# Altium schematic sheet MCU et al.SchDoc: MCU et al
size A3; DrawnBy: J Gray; Engineer: J Gray; SheetNumber: 1; SheetTotal: 1
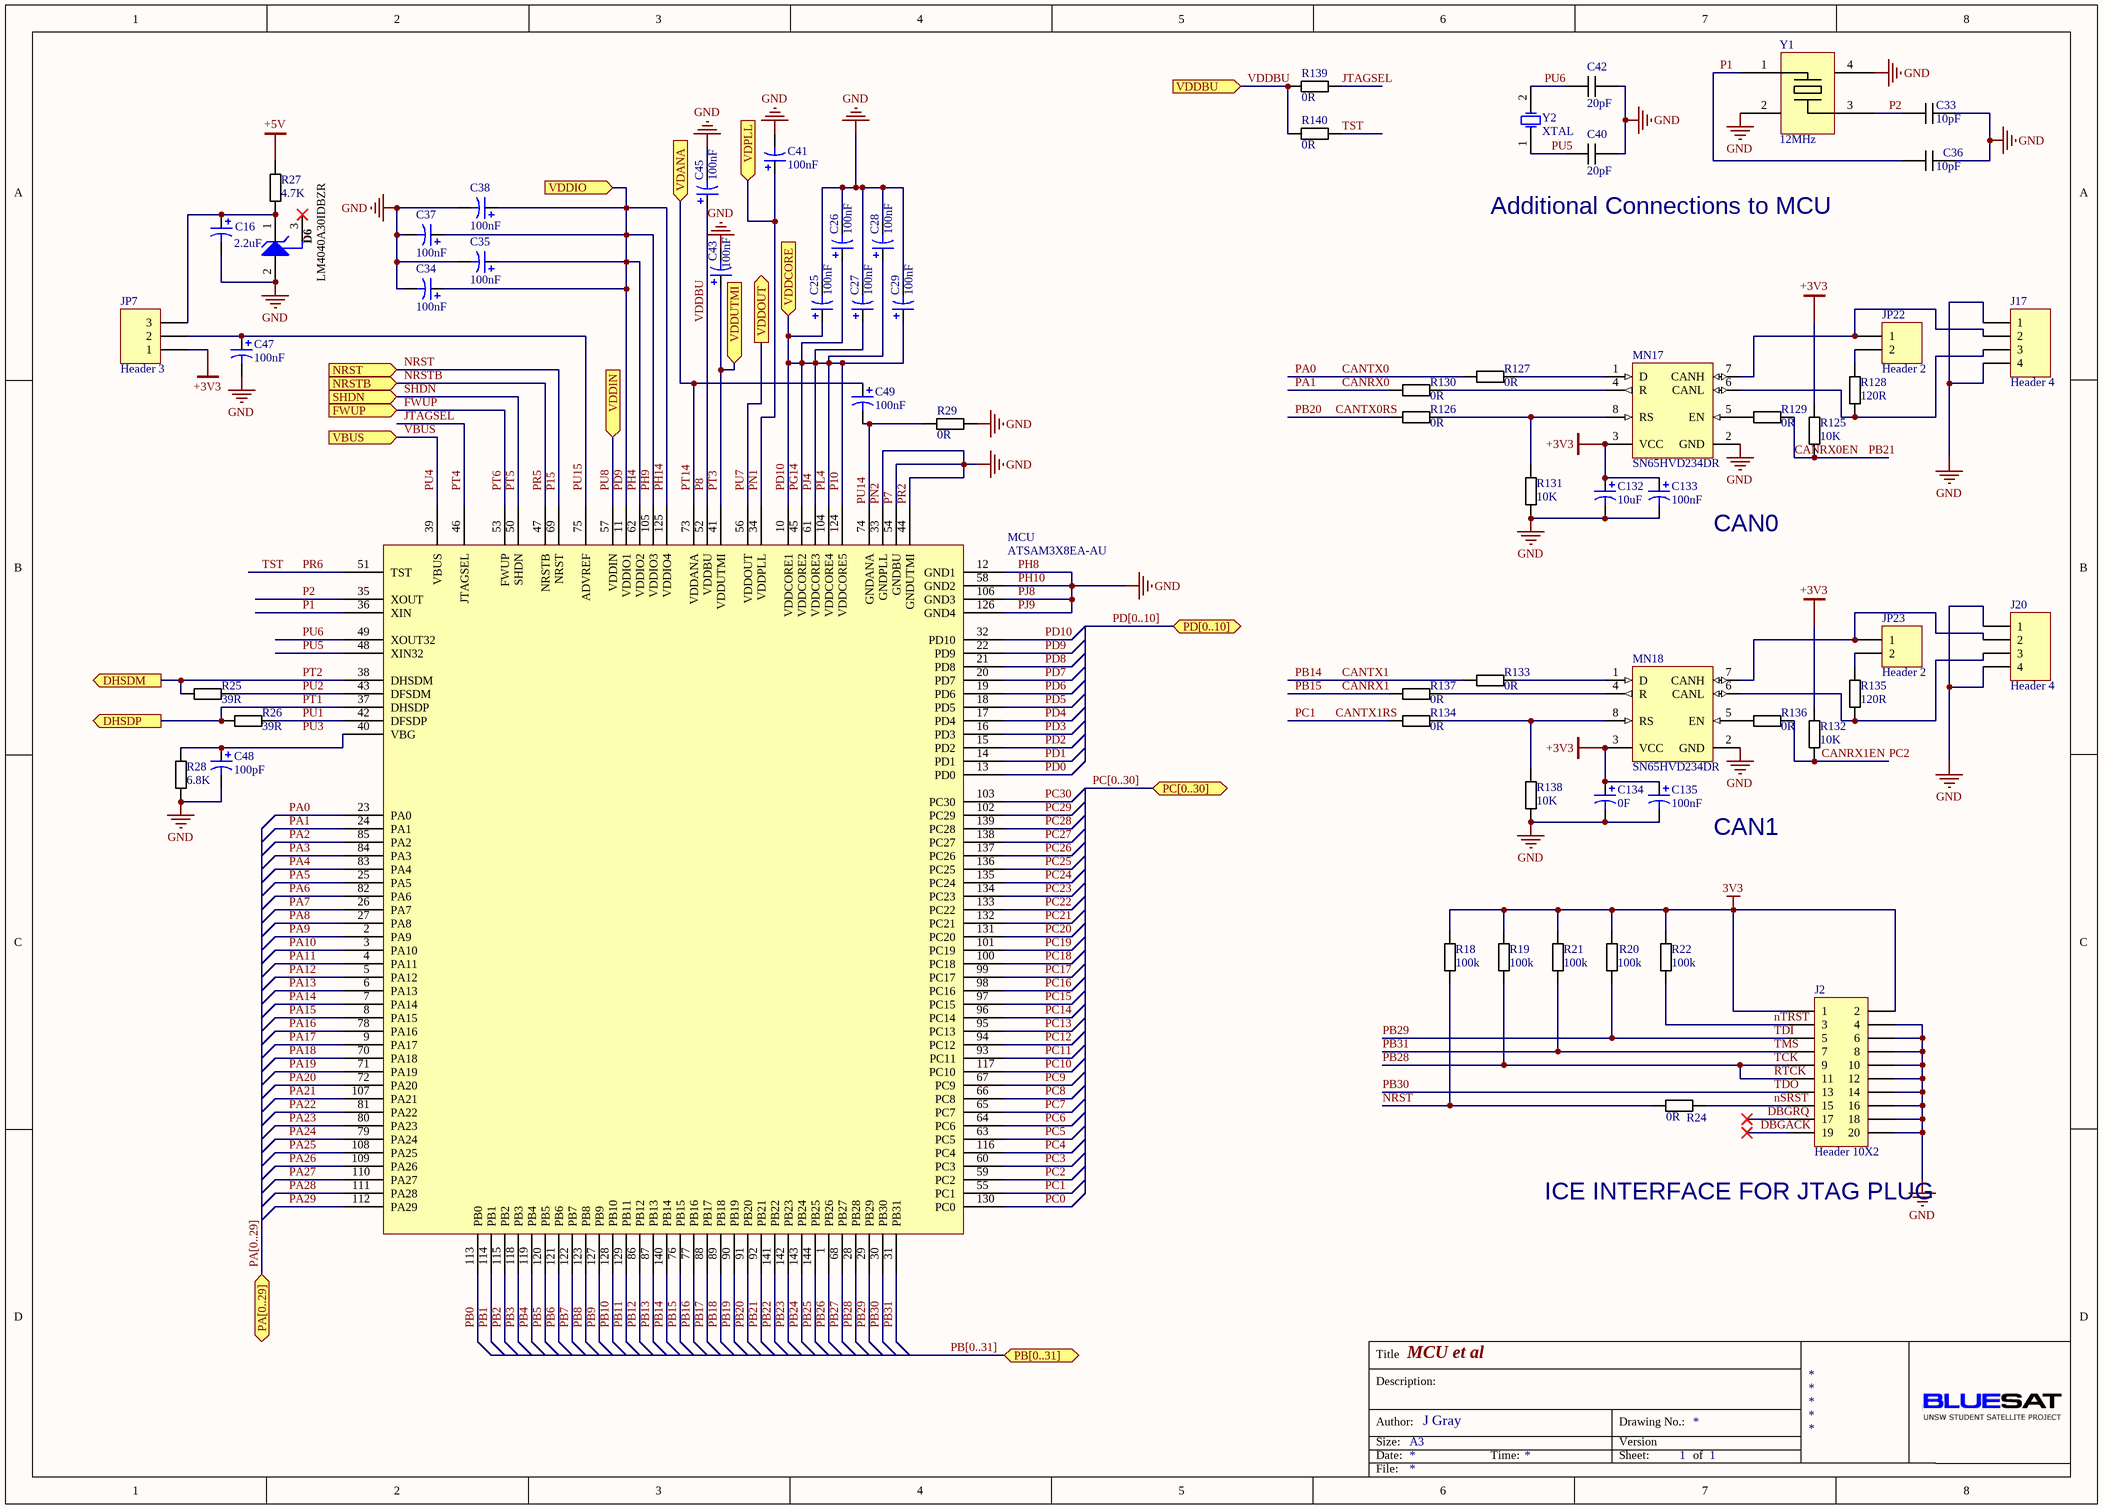
[diagram p0: MCU et al.SchDoc]

## Parts
C16  value 2.2uF  [0805 Cap]  (hidden comment: Cap Pol3)
C25  value 100nF  [0805 Cap]  (hidden comment: Cap Pol3)
C26  value 100nF  [0805 Cap]  (hidden comment: Cap Pol3)
C27  value 100nF  [0805 Cap]  (hidden comment: Cap Pol3)
C28  value 100nF  [0805 Cap]  (hidden comment: Cap Pol3)
C29  value 100nF  [0805 Cap]  (hidden comment: Cap Pol3)
C33  value 10pF  [0805 Cap]  (hidden comment: 0805 Cap)
C34  value 100nF  [0805 Cap]  (hidden comment: Cap Pol3)
C35  value 100nF  [0805 Cap]  (hidden comment: Cap Pol3)
C36  value 10pF  [0805 Cap]  (hidden comment: 0805 Cap)
C37  value 100nF  [0805 Cap]  (hidden comment: Cap Pol3)
C38  value 100nF  [0805 Cap]  (hidden comment: Cap Pol3)
C40  value 20pF  [0805 Cap]  (hidden comment: 0805 Cap)
C41  value 100nF  [0805 Cap]  (hidden comment: Cap Pol3)
C42  value 20pF  [0805 Cap]  (hidden comment: 0805 Cap)
C43  value 100nF  [0805 Cap]  (hidden comment: Cap Pol3)
C45  value 100nF  [0805 Cap]  (hidden comment: Cap Pol3)
C47  value 100nF  [0805 Cap]  (hidden comment: Cap Pol3)
C48  value 100pF  [0805 Cap]  (hidden comment: Cap Pol3)
C49  value 100nF  [0805 Cap]  (hidden comment: Cap Pol3)
C132  value 10uF  [0805 Cap]  (hidden comment: Cap Pol3)
C133  value 100nF  [0805 Cap]  (hidden comment: Cap Pol3)
C134  value 0F  [0805 Cap]  (hidden comment: Cap Pol3)
C135  value 100nF  [0805 Cap]  (hidden comment: Cap Pol3)
D6  LM4040A30IDBZR  [TI-DBZ3_N]
J2  Header 10X2  [HDR2X10 (JTAG)]
J17  Header 4  [HDR1X4]
J20  Header 4  [HDR1X4]
JP7  Header 3  [HDR1X3]
JP22  Header 2  [HDR1X2]
JP23  Header 2  [HDR1X2]
MCU  ATSAM3X8EA-AU  [LQFP144_M]
MN17  SN65HVD234DR  [D8_L]
MN18  SN65HVD234DR  [D8_L]
R18  value 100k  [0805 Resistor]  (hidden comment: 0805 Resistor)
R19  value 100k  [0805 Resistor]  (hidden comment: 0805 Resistor)
R20  value 100k  [0805 Resistor]  (hidden comment: 0805 Resistor)
R21  value 100k  [0805 Resistor]  (hidden comment: 0805 Resistor)
R22  value 100k  [0805 Resistor]  (hidden comment: 0805 Resistor)
R24  value 0R  [0805 Resistor]  (hidden comment: 0805 Resistor)
R25  value 39R  [0805 Resistor]  (hidden comment: 0805 Resistor)
R26  value 39R  [0805 Resistor]  (hidden comment: 0805 Resistor)
R27  value 4.7K  [0805 Resistor]  (hidden comment: 0805 Resistor)
R28  value 6.8K  [0805 Resistor]  (hidden comment: 0805 Resistor)
R29  value 0R  [0805 Resistor]  (hidden comment: 0805 Resistor)
R125  value 10K  [0805 Resistor]  (hidden comment: 0805 Resistor)
R126  value 0R  [0805 Resistor]  (hidden comment: 0805 Resistor)
R127  value 0R  [0805 Resistor]  (hidden comment: 0805 Resistor)
R128  value 120R  [0805 Resistor]  (hidden comment: 0805 Resistor)
R129  value 0R  [0805 Resistor]  (hidden comment: 0805 Resistor)
R130  value 0R  [0805 Resistor]  (hidden comment: 0805 Resistor)
R131  value 10K  [0805 Resistor]  (hidden comment: 0805 Resistor)
R132  value 10K  [0805 Resistor]  (hidden comment: 0805 Resistor)
R133  value 0R  [0805 Resistor]  (hidden comment: 0805 Resistor)
R134  value 0R  [0805 Resistor]  (hidden comment: 0805 Resistor)
R135  value 120R  [0805 Resistor]  (hidden comment: 0805 Resistor)
R136  value 0R  [0805 Resistor]  (hidden comment: 0805 Resistor)
R137  value 0R  [0805 Resistor]  (hidden comment: 0805 Resistor)
R138  value 10K  [0805 Resistor]  (hidden comment: 0805 Resistor)
R139  value 0R  [0805 Resistor]  (hidden comment: 0805 Resistor)
R140  value 0R  [0805 Resistor]  (hidden comment: 0805 Resistor)
Y1  12MHz  [7V-12.000MAAE-T]
Y2  XTAL  [ABS07]

## Ports
DHSDM (out), DHSDP (out), FWUP (in), NRST (in), NRSTB (in), PA[0..29] (bidir), PB[0..31] (bidir), PC[0..30] (bidir), PD[0..10] (bidir), SHDN (in), VBUS (in), VDANA (in), VDDBU (in), VDDCORE (in), VDDIN (in), VDDIO (in), VDDOUT (out), VDDUTMI (in), VDPLL (in)

## Nets
3V3: J2.1 J2.2 R18.2 R19.2 R20.2 R21.2 R22.2
+3V3: C132.1 C133.1 C134.1 C135.1 JP7.1 MN17.3(VCC) MN18.3(VCC) R125.2 R132.2
+5V: R27.2
P7: C16.2 C25.2 C26.2 C27.2 C28.2 C29.2 C33.2 C34.2 C35.2 C36.2 C37.2 C38.2 C40.2 C41.2 C42.2 C43.2 C45.2 C47.2 C48.2 C132.2 C133.2 C134.2 C135.2 D6.2(ANODE) J2.4 J2.6 J2.8 J2.10 J2.12 J2.14 J2.16 J2.18 J2.20 J17.1 J17.4 J20.1 J20.4 MCU.12(GND1) MCU.33(GNDPLL) MCU.44(GNDUTMI) MCU.54(GNDBU) MCU.58(GND2) MCU.106(GND3) MCU.126(GND4) MN17.2(GND) MN18.2(GND) R28.1 R29.1 R131.1 R138.1 Y1.2 Y1.4  [also labelled GND, PH10, PH8, PJ8, PJ9, PN2, PR2]
CANRX0: MCU.24(PA1) R130.1  [also labelled PA1]
CANRX0EN: MCU.92(PB21) R125.1 R129.2  [also labelled PB21]
CANRX1: MCU.76(PB15) R137.1  [also labelled PB15]
CANRX1EN: MCU.59(PC2) R132.1 R136.2  [also labelled PC2]
CANTX0: MCU.23(PA0) R127.1  [also labelled PA0]
CANTX0RS: MCU.91(PB20) R126.1  [also labelled PB20]
CANTX1: MCU.140(PB14) R133.1  [also labelled PB14]
CANTX1RS: MCU.55(PC1) R134.1  [also labelled PC1]
DBGACK: J2.19
DBGRQ: J2.17
FWUP: MCU.53(FWUP) ; port FWUP  [also labelled PT6]
JTAGSEL: MCU.46(JTAGSEL) R139.2  [also labelled PT4]
NRST: MCU.69(NRST) R18.1 R24.1 ; port NRST  [also labelled P15]
NRSTB: MCU.47(NRSTB) ; port NRSTB  [also labelled PR5]
nSRST: J2.15 R24.2
nTRST: J2.3 R22.1
P1: C36.1 MCU.36(XIN) Y1.1
P2: C33.1 MCU.35(XOUT) Y1.3
P8: C45.1 MCU.52(VDDBU) R139.1 R140.1 ; port VDDBU  [also labelled VDDBU]
P10: C25.1 C26.1 C27.1 C28.1 C29.1 MCU.10(VDDCORE1) MCU.32(PD10) MCU.45(VDDCORE2) MCU.61(VDDCORE3) MCU.104(VDDCORE4) MCU.124(VDDCORE5) ; port VDDCORE  [also labelled PD10, PG14, PJ4, PL4]
PA2: MCU.85(PA2)
PA3: MCU.84(PA3)
PA4: MCU.83(PA4)
PA5: MCU.25(PA5)
PA6: MCU.82(PA6)
PA7: MCU.26(PA7)
PA8: MCU.27(PA8)
PA9: MCU.2(PA9)
PA10: MCU.3(PA10)
PA11: MCU.4(PA11)
PA12: MCU.5(PA12)
PA13: MCU.6(PA13)
PA14: MCU.7(PA14)
PA15: MCU.8(PA15)
PA16: MCU.78(PA16)
PA17: MCU.9(PA17)
PA18: MCU.70(PA18)
PA19: MCU.71(PA19)
PA20: MCU.72(PA20)
PA21: MCU.107(PA21)
PA22: MCU.81(PA22)
PA23: MCU.80(PA23)
PA24: MCU.79(PA24)
PA25: MCU.108(PA25)
PA26: MCU.109(PA26)
PA27: MCU.110(PA27)
PA28: MCU.111(PA28)
PA29: MCU.112(PA29)
PB0: MCU.113(PB0)
PB1: MCU.114(PB1)
PB2: MCU.115(PB2)
PB3: MCU.118(PB3)
PB4: MCU.119(PB4)
PB5: MCU.120(PB5)
PB6: MCU.121(PB6)
PB7: MCU.122(PB7)
PB8: MCU.123(PB8)
PB9: MCU.127(PB9)
PB10: MCU.128(PB10)
PB11: MCU.129(PB11)
PB12: MCU.86(PB12)
PB13: MCU.87(PB13)
PB16: MCU.77(PB16)
PB17: MCU.88(PB17)
PB18: MCU.89(PB18)
PB19: MCU.90(PB19)
PB22: MCU.141(PB22)
PB23: MCU.142(PB23)
PB24: MCU.143(PB24)
PB25: MCU.144(PB25)
PB26: MCU.1(PB26)
PB27: MCU.68(PB27)
PB28: J2.9 J2.11 MCU.28(PB28) R19.1  [also labelled RTCK, TCK]
PB29: J2.5 MCU.29(PB29) R20.1  [also labelled TDI]
PB30: J2.13 MCU.30(PB30)  [also labelled TDO]
PB31: J2.7 MCU.31(PB31) R21.1  [also labelled TMS]
PC0: MCU.130(PC0)
PC3: MCU.60(PC3)
PC4: MCU.116(PC4)
PC5: MCU.63(PC5)
PC6: MCU.64(PC6)
PC7: MCU.65(PC7)
PC8: MCU.66(PC8)
PC9: MCU.67(PC9)
PC10: MCU.117(PC10)
PC11: MCU.93(PC11)
PC12: MCU.94(PC12)
PC13: MCU.95(PC13)
PC14: MCU.96(PC14)
PC15: MCU.97(PC15)
PC16: MCU.98(PC16)
PC17: MCU.99(PC17)
PC18: MCU.100(PC18)
PC19: MCU.101(PC19)
PC20: MCU.131(PC20)
PC21: MCU.132(PC21)
PC22: MCU.133(PC22)
PC23: MCU.134(PC23)
PC24: MCU.135(PC24)
PC25: MCU.136(PC25)
PC26: MCU.137(PC26)
PC27: MCU.138(PC27)
PC28: MCU.139(PC28)
PC29: MCU.102(PC29)
PC30: MCU.103(PC30)
PD0: MCU.13(PD0)
PD1: MCU.14(PD1)
PD2: MCU.15(PD2)
PD3: MCU.16(PD3)
PD4: MCU.17(PD4)
PD5: MCU.18(PD5)
PD6: MCU.19(PD6)
PD7: MCU.20(PD7)
PD8: MCU.21(PD8)
PD9: C34.1 C35.1 C37.1 C38.1 MCU.11(VDDIO1) MCU.22(PD9) MCU.62(VDDIO2) MCU.105(VDDIO3) MCU.125(VDDIO4) ; port VDDIO  [also labelled PH14, PH4, PH9]
PN1: C41.1 MCU.34(VDDPLL) ; port VDPLL
PR6: MCU.51(TST) R140.2  [also labelled TST]
PT1: MCU.37(DHSDP) R26.1 ; port DHSDP
PT2: MCU.38(DHSDM) R25.1 ; port DHSDM
PT3: C43.1 MCU.41(VDDUTMI) ; port VDDUTMI
PT5: MCU.50(SHDN) ; port SHDN  [also labelled SHDN]
PT14: C49.1 MCU.73(VDDANA) ; port VDANA
PU1: MCU.42(DFSDP) R26.2
PU2: MCU.43(DFSDM) R25.2
PU4: MCU.39(VBUS) ; port VBUS  [also labelled VBUS]
PU5: C40.1 MCU.48(XIN32) Y2.1(OSC1)
PU6: C42.1 MCU.49(XOUT32) Y2.2(OSC2)
PU7: MCU.56(VDDOUT) ; port VDDOUT
PU8: MCU.57(VDDIN) ; port VDDIN
PU14: C49.2 MCU.74(GNDANA) R29.2
PU15: C47.1 JP7.2 MCU.75(ADVREF)
NetC16_1: C16.1 D6.1(CATHODE) JP7.3 R27.1
NetC48_1: C48.1 MCU.40(VBG) R28.2
NetJ17_2: J17.2 JP22.1 MN17.7(CANH)
NetJ17_3: J17.3 MN17.6(CANL) R128.2
NetJ20_2: J20.2 JP23.1 MN18.7(CANH)
NetJ20_3: J20.3 MN18.6(CANL) R135.2
NetJP22_2: JP22.2 R128.1
NetJP23_2: JP23.2 R135.1
NetMN17_1: MN17.1(D) R127.2
NetMN17_4: MN17.4(R) R130.2
NetMN17_5: MN17.5(EN) R129.1
NetMN17_8: MN17.8(RS) R126.2 R131.2
NetMN18_1: MN18.1(D) R133.2
NetMN18_4: MN18.4(R) R137.2
NetMN18_5: MN18.5(EN) R136.1
NetMN18_8: MN18.8(RS) R134.2 R138.2

Not connected (* = marked no-connect by the designer): D6 3(NC)*

## Buses and harness runs
bus PA[0..29] = port PA[0..29]
bus PB[0..31] = port PB[0..31]
bus PC[0..30] = port PC[0..30]
bus PD[0..10] = port PD[0..10]

## Notes on the sheet
- (near C40) Additional Connections to MCU
- CAN0
- CAN1
- ICE INTERFACE FOR JTAG PLUG
- Labels drawn without touching a wire or pin: PU3
- Title
- Description:
- Size:
- Author:
- Date:
- A3
- Time:
- Version
- Sheet:
- Drawing No.:
- of
- File:

## Library data of the parts
C16 C25-C29 C34 C35 C37 C38 C41 C43 C45 C47-C49 C132-C135 = Cap Pol3: Polarized Capacitor (Surface Mount); Published: 8-Jun-2000; LatestRevisionDate: 29-May-2009; LatestRevisionNote: IPC-7351 Footprint Added.; PackageReference: C0805; Publisher: Altium Limited; PackageDescription: Chip Capacitor
C33 C36 C40 C42 = 0805 MLCC - X7R, 10%
D6 = LM4040A30IDBZR: Precision Micropower Shunt Voltage Reference, 0.1% accuracy, 3 V, 15 ppm / degC, 15 mA, -40 to 85 degC, 3-pin SOT-23 (DBZ), Green (RoHS & no Sb/Br); Manufacturer: Texas Instruments; Initial Accuracy @ 25/deg C(%): 0.1; Iout/Iz(Max)(mA): 15; Min Iz for Regulation(uA): 62; Rating: Catalog; Temp Coeff(Max)(ppm/ degree C): 100; VO(V): 3; DatasheetVersion: SLOS456K; PackageVersion: 4203227/B; PackageReference: DBZ3; PackageDescription: 3-Pin Plastic Small Outline, Body 2.92 x 1.3 mm, Pitch 0.95 mm; Supplier 1: Digi-Key; Supplier Part Number 1: 296-20861-2-ND; Supplier 2: Digi-Key; Supplier Part Number 2: 296-20861-1-ND; Supplier 3: Digi-Key; Supplier Part Number 3: 296-20861-6-ND; Supplier 4: Newark; Supplier Part Number 4: 66K2439; Supplier 5: Mouser; Supplier Part Number 5: 595-LM4040A30IDBZR; Eco-Plan: Green (RoHS & no Sb/Br); SubFamily: Shunt Voltage Reference; Temp Coeff(Typ)(ppm/ degree C): 15; Mounting Technology: Surface Mount; Code_JEDEC: TO-236; PartNumber: LM4040A30IDBZR; ComponentLink1Description: Manufacturer URL; ComponentLink1URL: http://www.ti.com/; ComponentLink2Description: Datasheet; ComponentLink2URL: http://www.ti.com/general/docs/lit/getliterature.tsp?genericPartNumber=LM4040A30&fileType=pdf; ComponentLink3Description: Package Specification; ComponentLink3URL: http://www.ti.com/litv/pdf/mpds108a
J2 = Header 10X2: Header, 10-Pin, Dual row; LatestRevisionDate: 17-Jul-2002; LatestRevisionNote: Re-released for DXP Platform.; Publisher: Altium Limited
J17 J20 = Header 4: Header, 4-Pin; LatestRevisionDate: 17-Jul-2002; LatestRevisionNote: Re-released for DXP Platform.; Publisher: Altium Limited
JP7 = Header 3: Header, 3-Pin, fix symbol later; LatestRevisionDate: 17-Jul-2002; LatestRevisionNote: Re-released for DXP Platform.; Publisher: Altium Limited
JP22 JP23 = Header 2: Header, 2-Pin; Manufacturer: Molex; Supplier: Digikey; Supplier P/N: WM6440-ND; Manufacturer P/N: 22-28-4025
MCU = ATSAM3X8E: ATSAM3X8EA-AU ARM CORTEX M3 Microcontroller
MN17 = SN65HVD234DR: 3.3V CAN Transceiver with Sleep Mode, 6 mA, -40 to Digi-Key Number 296-27991-1-ND; Manufacturer: Texas Instruments; Eco-Plan: Green (RoHS & no Sb/Br); Drivers Per Package: 1; Isolated: No; Bus Fault Voltage(V): +/-30; Transient Pulse Protection(V): -100 to 100; ICC(Max)(mA): 6; Supply Voltage(s)(V): 3.3; Rating: Catalog; DatasheetVersion: SLLS557F; PackageVersion: revM, Jun-2011; PackageReference: D8; PackageDescription: 8-Pin Plastic Small Outline Integrated Circuit, 4.9 x 3.9 mm, Pitch 1.27 mm Pitch; Supplier 1: Digi-Key; Supplier Part Number 1: 296-27991-2-ND; Supplier 2: Digi-Key; Supplier Part Number 2: 296-27991-1-ND; Supplier 3: Digi-Key; Supplier Part Number 3: 296-27991-6-ND; Supplier 4: Farnell; Supplier Part Number 4: 1408716; Supplier 5: Newark; Supplier Part Number 5: 73H4408; Supplier 6: Mouser; Supplier Part Number 6: 595-SN65HVD234DR; SubFamily: CAN; Receivers Per Package: 1; Low Power Mode: Sleep; Footprint: PCA82C250, excludes pin5; Mounting Technology: Surface Mount; PartNumber: SN65HVD234DR; Code_JEDEC: MS-012AA; ComponentLink1Description: Datasheet; ComponentLink1URL: http://www.ti.com/general/docs/lit/getliterature.tsp?genericPartNumber=SN65HVD234&fileType=pdf
MN18 = SN65HVD234DR: Digi-Key Number 296-27991-1-ND; Manufacturer: Texas Instruments; Eco-Plan: Green (RoHS & no Sb/Br); SubFamily: CAN; Drivers Per Package: 1; Isolated: No; Bus Fault Voltage(V): +/-30; Transient Pulse Protection(V): -100 to 100; Low Power Mode: Sleep; ICC(Max)(mA): 6; Supply Voltage(s)(V): 3.3; Rating: Catalog; DatasheetVersion: SLLS557F; PackageVersion: revM, Jun-2011; PackageReference: D8; PackageDescription: 8-Pin Plastic Small Outline Integrated Circuit, 4.9 x 3.9 mm, Pitch 1.27 mm Pitch; Supplier 1: Digi-Key; Supplier Part Number 1: 296-27991-2-ND; Supplier 2: Digi-Key; Supplier Part Number 2: 296-27991-1-ND; Supplier 3: Digi-Key; Supplier Part Number 3: 296-27991-6-ND; Supplier 4: Farnell; Supplier Part Number 4: 1408716; Supplier 5: Newark; Supplier Part Number 5: 73H4408; Supplier 6: Mouser; Supplier Part Number 6: 595-SN65HVD234DR; Receivers Per Package: 1; Footprint: PCA82C250, excludes pin5; Mounting Technology: Surface Mount; PartNumber: SN65HVD234DR; Code_JEDEC: MS-012AA; ComponentLink1Description: Datasheet; ComponentLink1URL: http://www.ti.com/general/docs/lit/getliterature.tsp?genericPartNumber=SN65HVD234&fileType=pdf
R18-R22 R24-R29 R125-R140 = 0805 Thick Film Resistor 1%
Y1 = 4-Pin Oscillator: Digi-Key Part Number 887-1458-1-ND
Y2 = XTAL: Digikey Number: 535-9544-1-ND; Published: 8-Jun-2000; LatestRevisionDate: 17-Jul-2002; LatestRevisionNote: Re-released for DXP Platform.; PackageReference: R38; Publisher: Altium Limited; PackageDescription: Crystal, Thru-Hole; 2 Leads; Body 3.1 x 8.2 mm (Dia.xH)